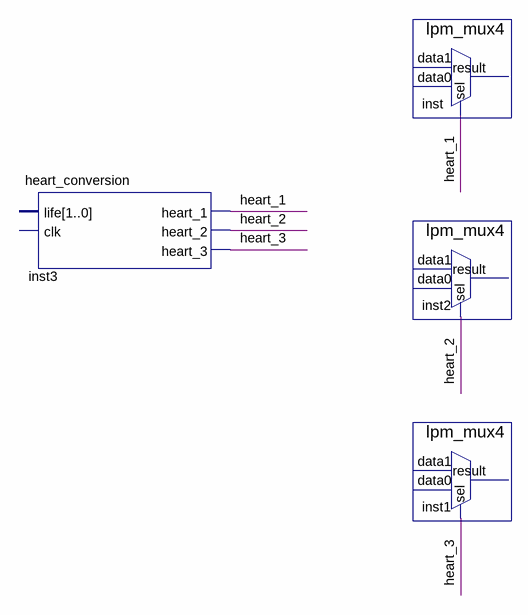
[diagram p0: schematic sheet]
// Quartus schematic life_heart.bdf as structural Verilog: 4 symbols, 0 pins
module life_heart (
);

  wire heart_1, heart_2, heart_3;

  heart_conversion inst3 (.heart_1(heart_1), .heart_2(heart_2), .heart_3(heart_3));  // open: life, clk
  lpm_mux4 inst (.sel(heart_1));  // open: data1, data0, result
  lpm_mux4 inst2 (.sel(heart_2));  // open: data1, data0, result
  lpm_mux4 inst1 (.sel(heart_3));  // open: data1, data0, result
endmodule
